# EAGLE design magspoof (EAGLE 7.5.0)
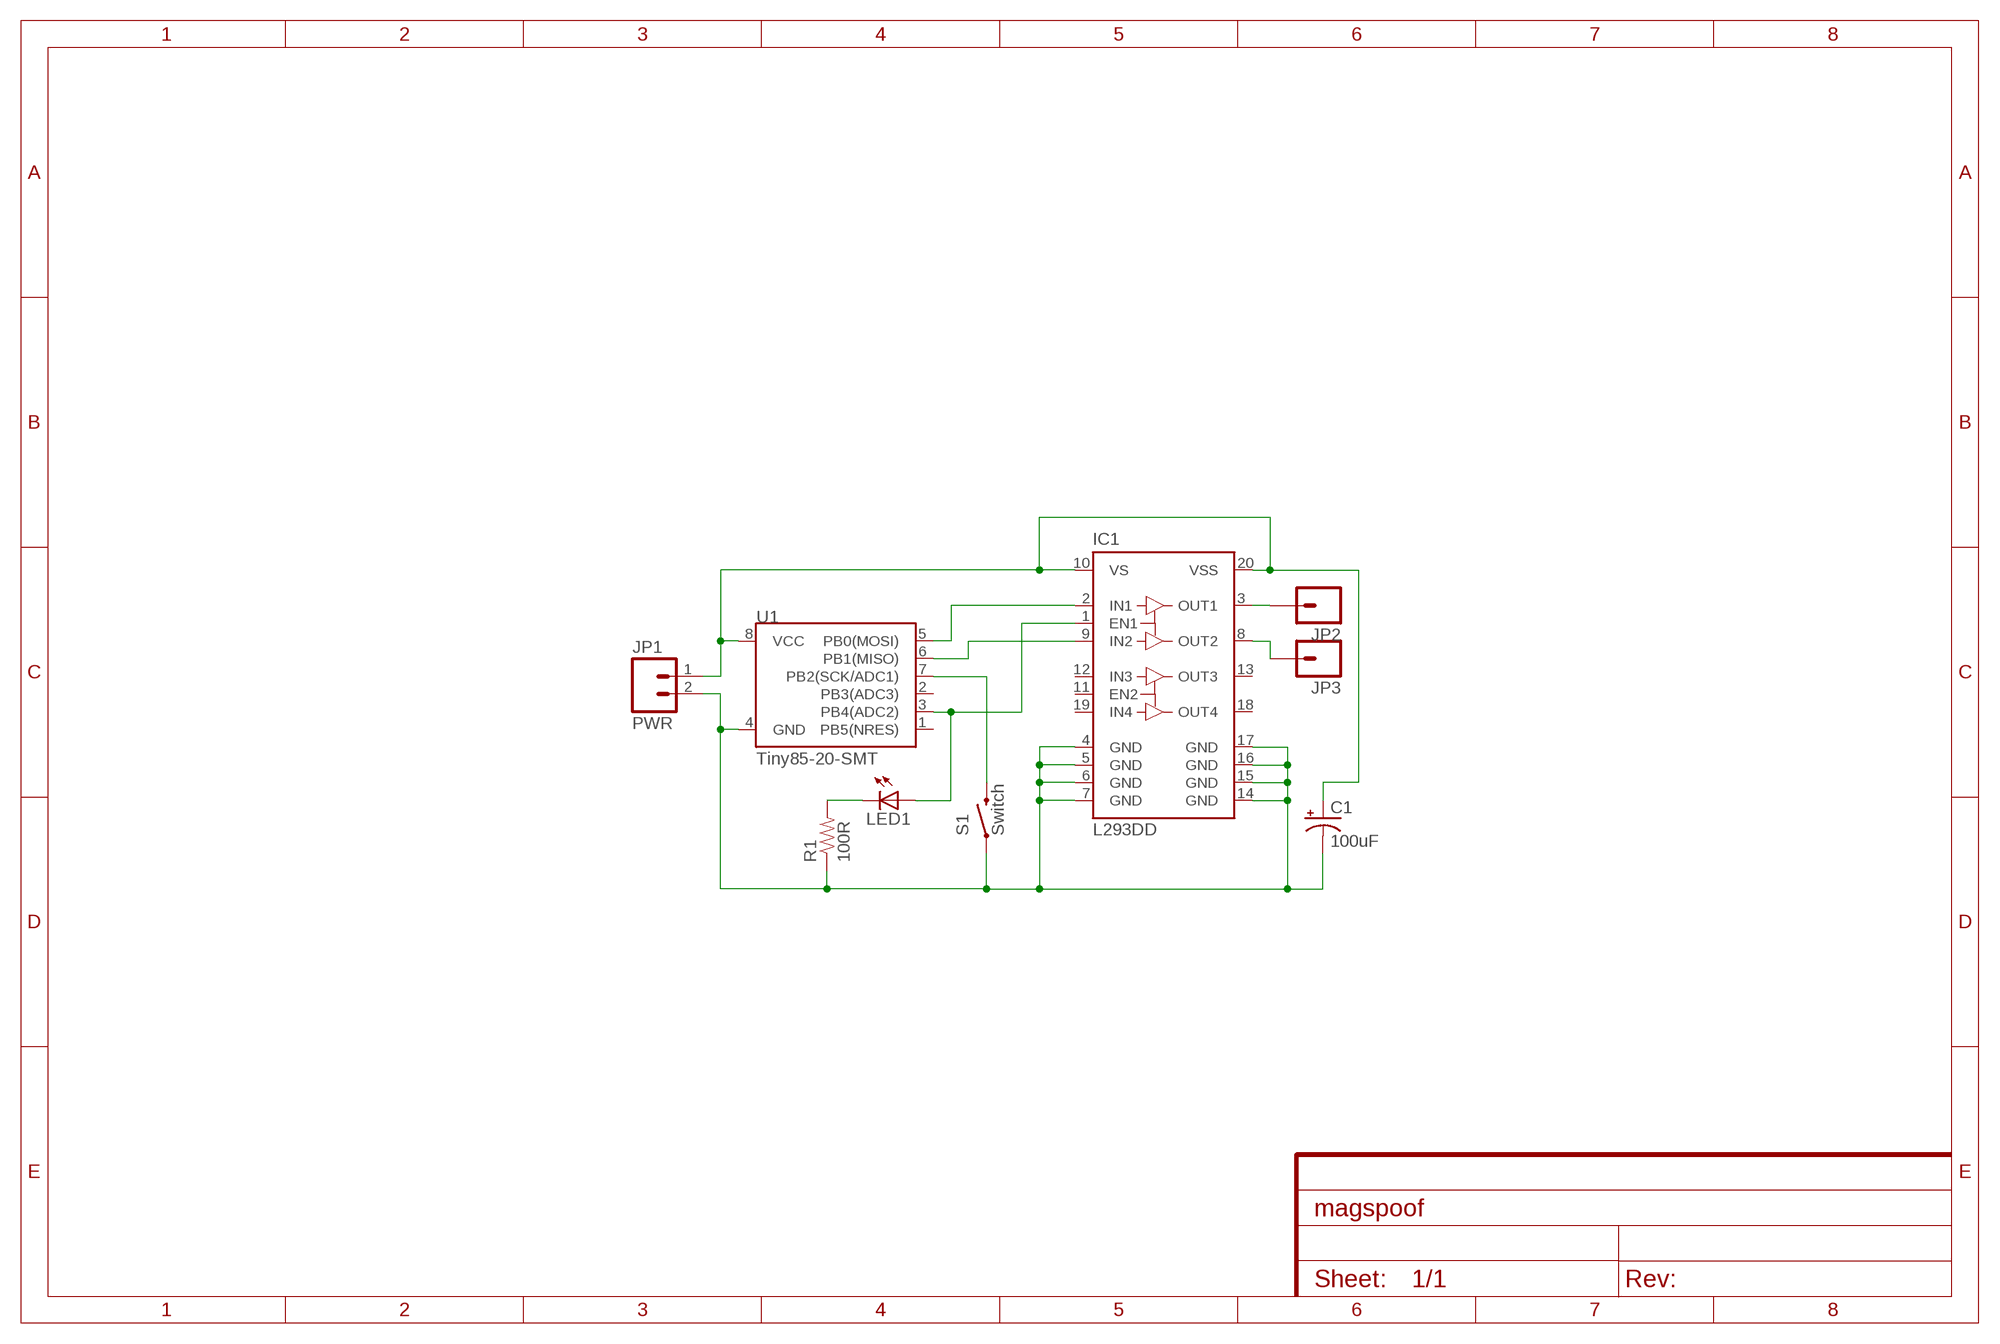
[diagram p0: schematic, sheet 1]

## Parts
C1  100uF  100UF-63V-20%(ELECT)  [NIC_10X10.5_CAP]
IC1  L293DD  [SO20]
JP1  PWR  M02-JST-2MM-SMT  [JST-2-SMD]
JP2  M01SMDNS  [1X01NS]
JP3  M01SMDNS  [1X01NS]
LED1  LEDCHIP-LED0805  [CHIP-LED0805]
R1  100R  RESISTOR0603-RES  [0603-RES]
S1  Switch  SWITCH-MOMENTARY-2SMD-REDUNDANT  [TACTILE-SWITCH-SMD]
U1  Tiny85-20-SMT  ATTINY45TINY85-20-SMT  [SO08-EIAJ]

## Nets
N$1: C1.+ IC1.10(VS) IC1.20(VSS) JP1.1 U1.8(VCC)
N$2: C1.- IC1.4(GND) IC1.5(GND) IC1.6(GND) IC1.7(GND) IC1.14(GND) IC1.15(GND) IC1.16(GND) IC1.17(GND) JP1.2 R1.1 S1.1 S1.2 U1.4(GND)
N$3: LED1.C R1.2
N$4: S1.3 S1.4 U1.7(PB2(SCK/ADC1))
N$5: IC1.1(EN1) LED1.A U1.3(PB4(ADC2))
N$6: IC1.3(OUT1) JP2.1
N$7: IC1.8(OUT2) JP3.1
N$9: IC1.2(IN1) U1.5(PB0(MOSI))
N$10: IC1.9(IN2) U1.6(PB1(MISO))
Unconnected: IC1.11(EN2) IC1.12(IN3) IC1.13(OUT3) IC1.18(OUT4) IC1.19(IN4) U1.1(PB5(NRES)) U1.2(PB3(ADC3))

## Library data of the parts
C1 = SparkFun-Capacitors:100UF-63V-20%(ELECT): CAP-08362 100uF electrolytic SMT 63V 20%; PROD_ID: CAP-08362
IC1 = st-microelectronics:L293DD: PUSH-PULL FOUR CHANNEL DRIVER WITH DIODES Source: http://www.st.com/stonline/books/pdf/docs/1330.pdf; OC_FARNELL: unknown
JP1 = SparkFun-Connectors:M02: Standard 2-pin 0.1" header. Use with - straight break away headers ( PRT-00116) - right angle break away headers (PRT-00553) - swiss pins (PRT-00743) - machine pins (PRT-00117) - female headers (PRT-00115) Molex polarized connector foot print use with: PRT-08233 with associated crimp pins and housings. 2.54_SCREWTERM for use with PRT-10571. 3.5mm Screw Terminal footprints for PRT-08084 5mm Screw Terminal footprints for use with PRT-08432; PROD_ID: CONN-11443
JP2 JP3 = SparkFun-Connectors:M01: Header 1 Standard 1-pin 0.1" header. Use with straight break away headers (SKU : PRT-00116), right angle break away headers (PRT-00553), swiss pins (PRT-00743), machine pins (PRT-00117), and female headers (PRT-00115).
LED1 = adafruit:LED: LED OSRAM: - CHIPLED LG R971, LG N971, LY N971, LG Q971, LY Q971, LO R971, LY R971 LH N974, LH R974 LS Q976, LO Q976, LY Q976 LO Q996 - Hyper CHIPLED LW Q18S LB Q993, LB Q99A, LB R99A - SideLED LS A670, LO A670, LY A670, LG A670, LP A670 LB A673, LV A673, LT A673, LW A673 LH A674 LY A675 LS A676, LA A676, LO A676, LY A676, LW A676 LS A679, LY A679, LG A679 - Hyper Micro SIDELED® LS Y876, LA Y876, LO Y876, LY Y876 LT Y87S - SmartLED LW L88C, LW L88S LB L89C, LB L89S, LG L890 LS L89K, LO L89K, LY L89K LS L896, LA L896, LO L896, LY L896 - TOPLED LS T670, LO T670, LY T670, LG T670, LP T670 LSG T670, LSP T670, LSY T670, LOP T670, LYG T670 LG T671, LOG T671, LSG T671 LB T673, LV T673, LT T673, LW T673 LH T674 LS T676, LA T676, LO T676, LY T676, LB T676, LH T676, LSB T676, LW T676 LB T67C, LV T67C, LT T67C, LS T67K, LO T67K, LY T67K, LW E67C LS E67B, LA E67B, LO E67B, LY E67B, LB E67C, LV E67C, LT E67C LW T67C LS T679, LY T679, LG T679 LS T770, LO T770, LY T770, LG T770, LP T770 LB T773, LV T773, LT T773, LW T773 LH T774 LS E675, LA E675, LY E675, LS T675 LS T776, LA T776, LO T776, LY T776, LB T776 LHGB T686 LT T68C, LB T68C - Hyper Mini TOPLED® LB M676 - Mini TOPLED Santana® LG M470 LS M47K, LO M47K, LY M47K Source: http://www.osram.convergy.de/
R1 = SparkFun-Passives:RESISTOR: Resistor Basic schematic elements and footprints for 0603, 1206, and PTH resistors.
S1 = SparkFun-Electromechanical:SWITCH-MOMENTARY-2: Various NO switches- pushbuttons, reed, etc; PROD_ID: SWCH-08247
U1 = SparkFun-DigitalIC:ATTINY45: Atmel 8-pin 2/4/8kB flash uC; PROD_ID: IC-09092

## Board
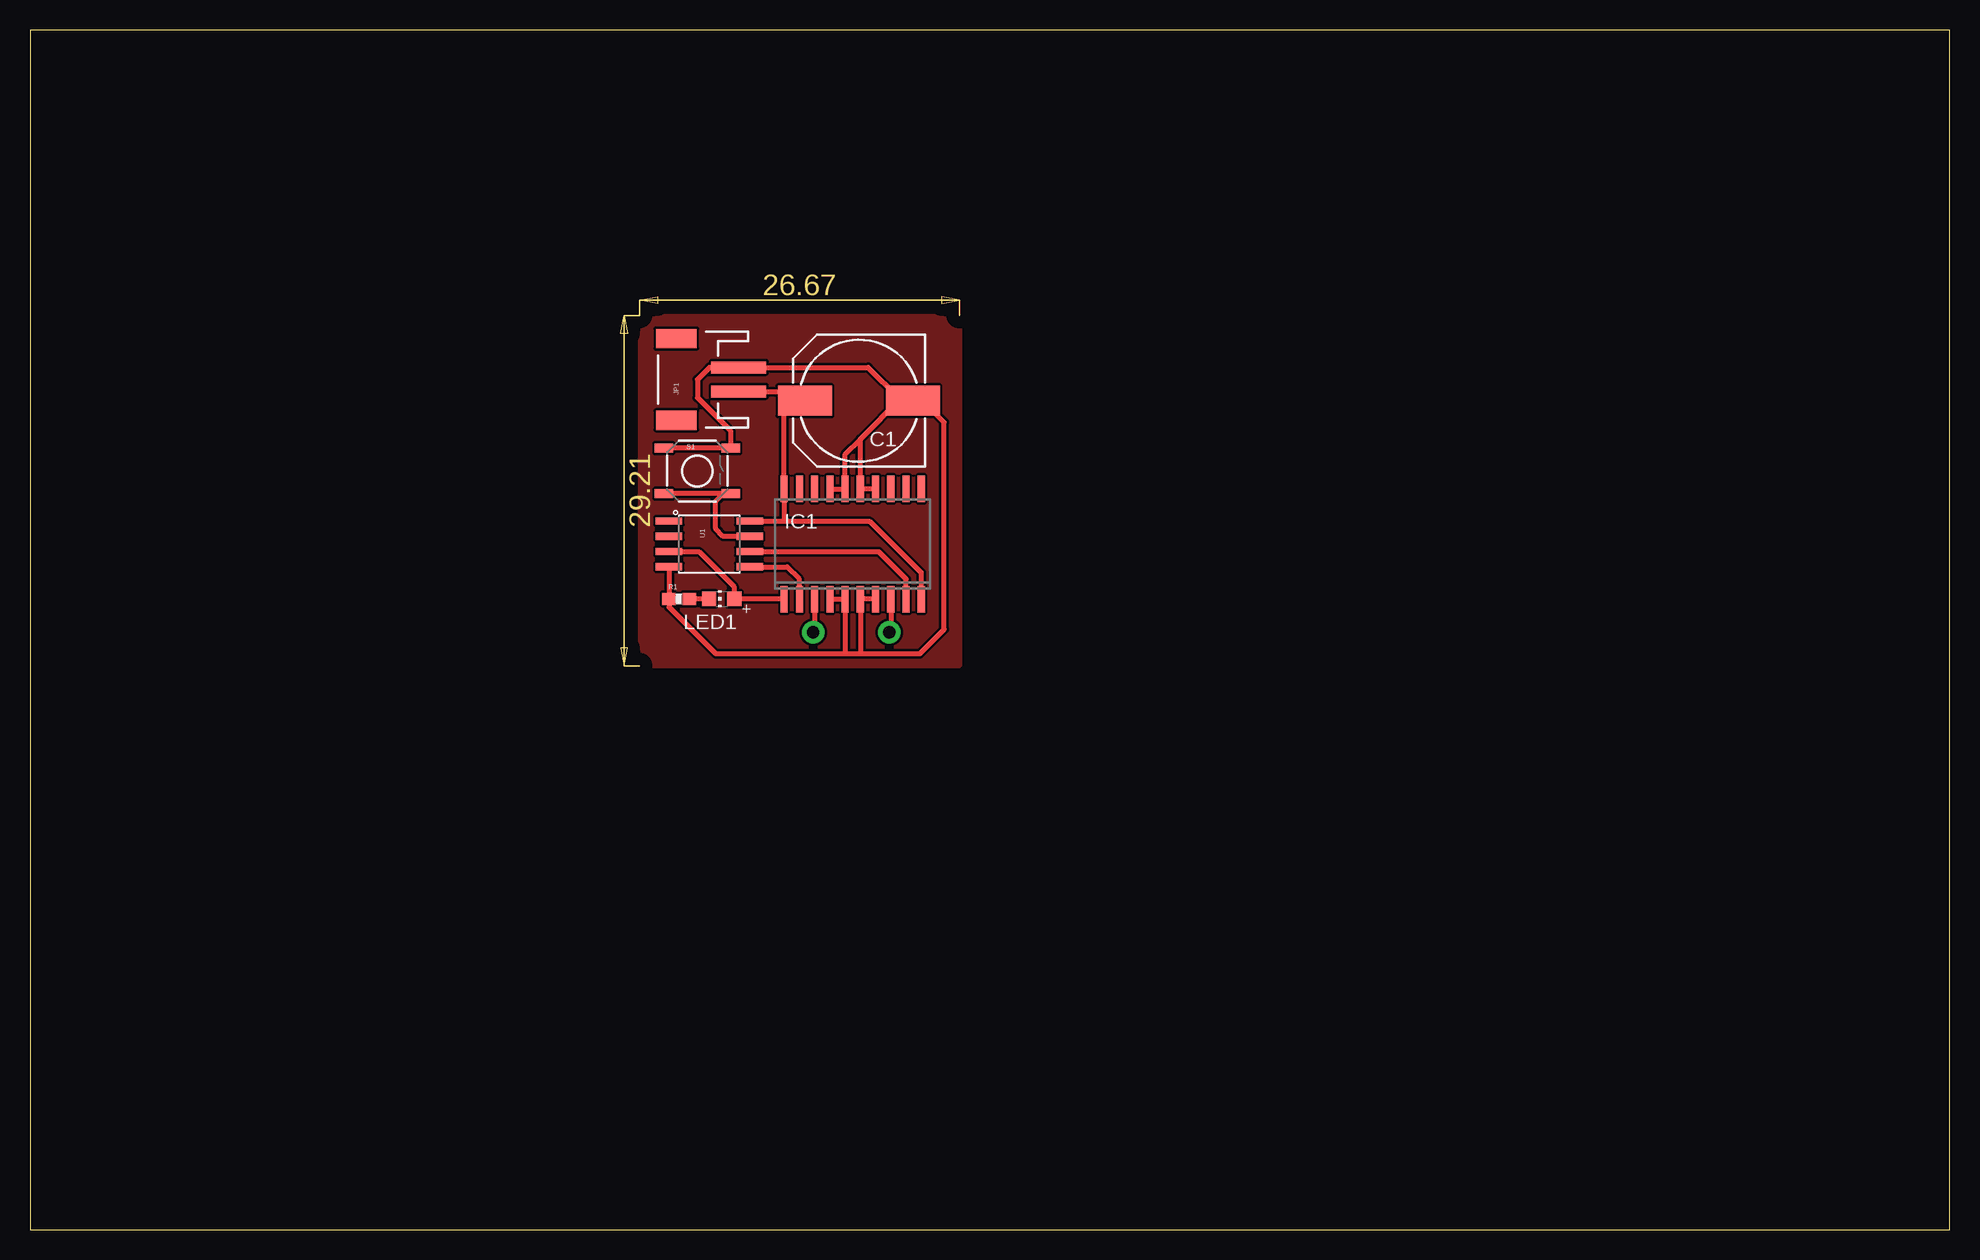
[diagram p1: board, top side]

Size 160 x 100 mm. Coordinates in mm from the lower left corner, seen from the top.
Outline: 0,0 160,0 160,100 0,100 0,0
Copper layers (1*16): Top 0.035mm / dielectric 1.5mm / Bottom 0.035mm
Design rules "default": minimum track width 10mil, minimum drill 24mil, track to track 8mil, track to pad 8mil, pad to pad 8mil, via to via 8mil, smd to smd 8mil, copper to edge 40mil, drill to drill 8mil, minimum pad ring 10mil, minimum via ring 8mil, stop-mask expansion 4mil, vias tented up to drill 0mil, thermal gap 10mil

### Footprints (pad centres in the part's own frame; a part is rotated, then mirrored left to right if it is on the bottom)
NIC_10X10.5_CAP = smd 4.5 x 2.5: + 4.5,0; - -4.5,0
SO20 = smd 0.6 x 2.2: 1 -5.715,-4.6; 2 -4.445,-4.6; 3 -3.175,-4.6; 4 -1.905,-4.6; 5 -0.635,-4.6; 6 0.635,-4.6; 7 1.905,-4.6; 8 3.175,-4.6; 9 4.445,-4.6; 10 5.715,-4.6; 11 5.715,4.6; 12 4.445,4.6; 13 3.175,4.6; 14 1.905,4.6; 15 0.635,4.6; 16 -0.635,4.6; 17 -1.905,4.6; 18 -3.175,4.6; 19 -4.445,4.6; 20 -5.715,4.6
JST-2-SMD = smd 1 x 4.6: 1 -1,-3.7; 2 1,-3.7 | smd 1.6 x 3.4: NC1 -3.4,1.5; NC2 3.4,1.5
1X01NS = drill 1.016 pad 1.88: 1 0,0
CHIP-LED0805 = smd 1.2 x 1.2: A 0,-1.05; C 0,1.05
0603-RES = smd 1.1 x 1: 1 -0.85,0; 2 0.85,0
TACTILE-SWITCH-SMD = smd 1.524 x 0.762: 1 -2.794,1.905; 2 2.794,1.905; 3 -2.794,-1.905; 4 2.794,-1.905
SO08-EIAJ = smd 0.61 x 2.21: 1 -1.905,-3.378; 2 -0.635,-3.378; 3 0.635,-3.378; 4 1.905,-3.378; 5 1.905,3.353; 6 0.635,3.353; 7 -0.635,3.353; 8 -1.905,3.353

### Placement (x,y rotation side)
C1  69.09,69.09 180 top
IC1  68.58,57.15 0 top
JP1  55.37,70.87 90 top
JP2  65.28,49.78 0 top
JP3  71.63,49.78 0 top
LED1  57.66,52.58 90 top
R1  54.1,52.58 0 top
S1  55.63,63.25 0 top
U1  56.64,57.15 270 top

### Tracks (layer width: path | path; a pad name or v marks a point on that pad's centre or on a via)
N$1
  Top 0.406: U1.8 62.99,59.05 | 62.99,59.05 69.98,59.05 74.3,54.74 IC1.10 | 62.99,59.05 62.87,59.18 IC1.20 62.87,68.96 62.99,69.09 C1.+ 63.81,69.87 JP1.1
N$2
  Top 0.406: S1.1 S1.2 58.42,66.55 55.63,69.34 55.63,70.87 56.63,71.87 JP1.2 69.87,71.87 72.39,69.34 72.64,69.34 | R1.1 53.26,52.59 U1.4 53.26,51.89 57.15,48.01 68.07,48.01 | 72.64,69.34 73.33,69.34 C1.- 73.84,69.34 74.17,69.34 76.2,67.31 76.2,50.04 74.17,48.01 69.34,48.01 | 68.07,48.01 69.34,48.01 | 68.07,48.01 67.94,48.13 IC1.5 IC1.4 | 69.34,48.01 69.22,48.13 IC1.6 IC1.7 | 69.22,65.91 67.94,64.64 IC1.16 IC1.17 | 69.22,65.91 72.64,69.34 | 69.22,65.91 IC1.15 IC1.14
N$3
  Top 0.406: LED1.C R1.2
N$4
  Top 0.406: U1.7 57.78,57.78 57.15,58.42 57.15,60.71 57.91,61.47 58.29,61.47 S1.4 S1.3
N$5
  Top 0.406: U1.3 55.75,56.52 58.67,53.59 58.67,52.61 LED1.A 58.74,52.55 IC1.1
N$6
  Top 0.406: IC1.3 65.41,49.91 JP2.1
N$7
  Top 0.406: IC1.8 71.75,49.91 JP3.1
N$8
  pour Top: 50.8,76.2 77.47,76.2 77.47,46.99 50.8,46.99
N$9
  Top 0.406: IC1.2 64.14,54.23 63.12,55.24 U1.5
N$10
  Top 0.406: U1.6 70.74,56.52 73.03,54.23 IC1.9